# EAGLE schematic nucleo power supply schematic (EAGLE 7.7.0)
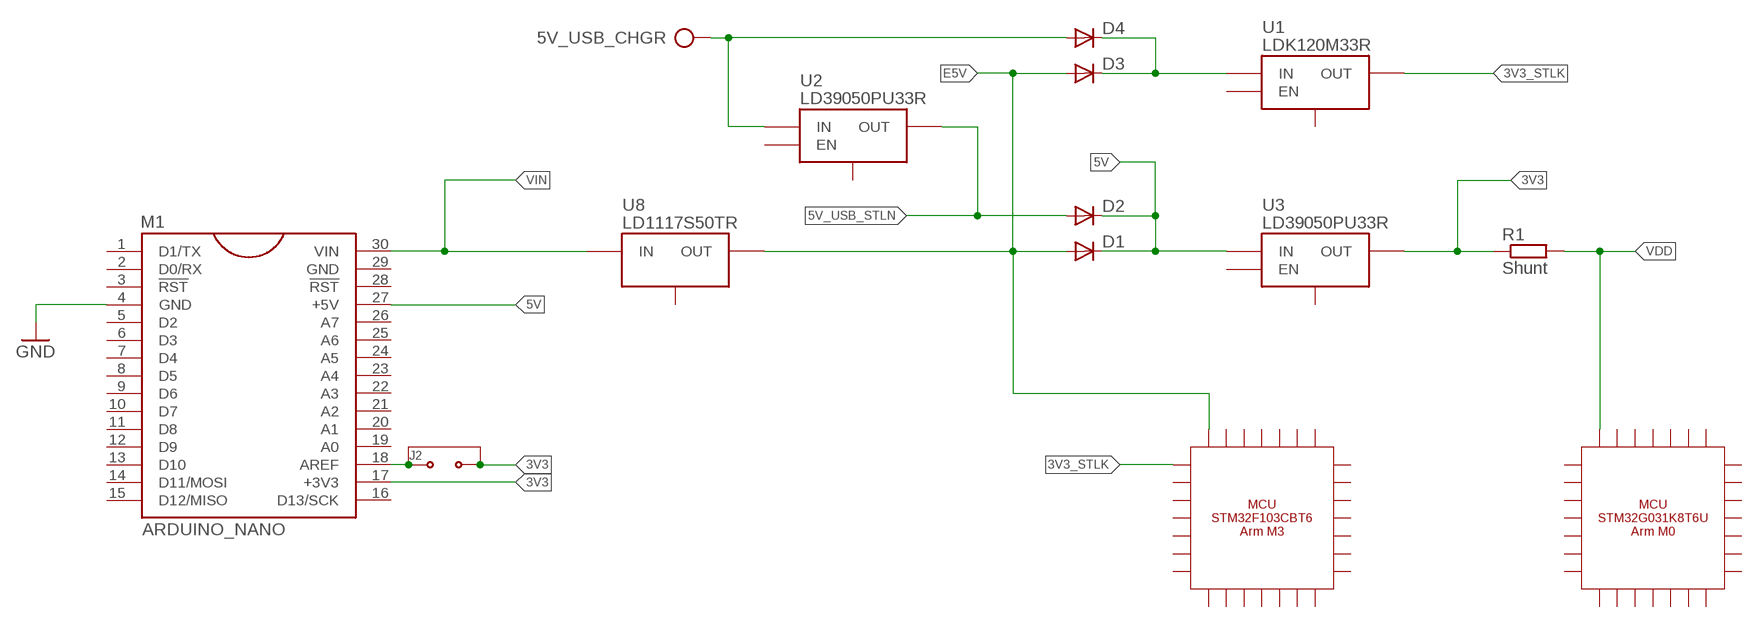
[diagram p0: schematic, sheet 1]

## Parts
D1  D  [1X02]
D2  D  [1X02]
D3  D  [1X02]
D4  D  [1X02]
J2  CON-J2  [CON-HEADER-M-RM254-1X02]
M1  ARDUINO_NANO  [ARDUINO_NANO]
R1  Shunt  R  [1X02]
U1  LDK120M33R  VREG04  [1X04]
U2  LD39050PU33R  VREG04  [1X04]
U3  LD39050PU33R  VREG04  [1X04]
U8  LD1117S50TR  VREG03  [1X03]
X1  5V_USB_CHGR  CON-KLEMME  [1X01]

## Nets
3V3: J2.2 M1.17(+3V3) R1.1 U3.4(OUT)
3V3_STLK: U1.4(OUT)
5V: D1.2(C) D2.2(C) M1.27(+5V) U3.3(IN)
5V_USB_CHGR: D4.1(A) U2.3(IN) X1.1(KL)
5V_USB_STLN: D2.1(A) U2.4(OUT)
AVDD: J2.1 M1.18(AREF)
E5V: D1.1(A) D3.1(A) U8.3(OUT)
GND: M1.4(GND)
N$1: D3.2(C) D4.2(C) U1.3(IN)
VDD: R1.2
VIN: M1.30(VIN) U8.1(IN)
Unconnected: M1.1(D1/TX) M1.2(D0/RX) M1.3(!RST) M1.5(D2) M1.6(D3) M1.7(D4) M1.8(D5) M1.9(D6) M1.10(D7) M1.11(D8) M1.12(D9) M1.13(D10) M1.14(D11/MOSI) M1.15(D12/MISO) M1.16(D13/SCK) M1.19(A0) M1.20(A1) M1.21(A2) M1.22(A3) M1.23(A4) M1.24(A5) M1.25(A6) M1.26(A7) M1.28(!RST) M1.29(GND) U1.1 U1.2(EN) U2.1 U2.2(EN) U3.1 U3.2(EN) U8.2

## Notes on the sheet
- MCU
  STM32F103CBT6
  Arm M3
- MCU
  STM32G031K8T6U
  Arm M0

## Library data of the parts
D1-D4 = symbols:D: Small Signal Diode
J2 = con-div:CON-J2: Jumper 2pol.
M1 = Arduino:ARDUINO_NANO: Arduino Nano plug in module
R1 = symbols:R: RESISTOR, European symbol
U1-U3 = symbols:VREG04
U8 = symbols:VREG03
X1 = symbols:CON-KLEMME